# Altium project EGT_CAN.PrjPcb
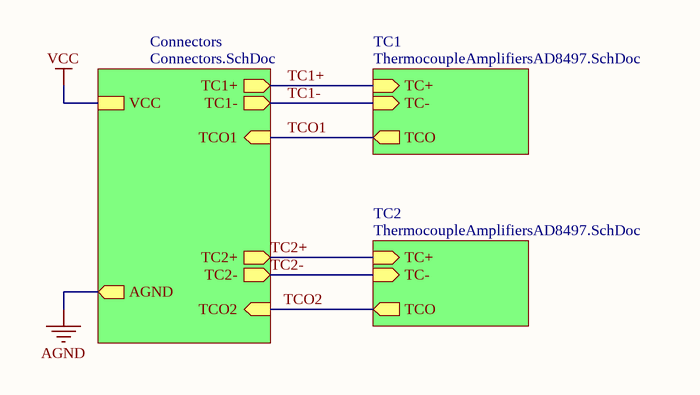
[diagram p0: Top Level.SchDoc]
3 sheets, 29 parts. Net scope: hierarchical (ports join the sheet entries above them; power ports are global).
Board file: EGT_CAN.PcbDoc
Sheets:
  Top Level.SchDoc
    TC1 = ThermocoupleAmplifiersAD8497.SchDoc
    TC2 = ThermocoupleAmplifiersAD8497.SchDoc
    Connectors = Connectors.SchDoc

## Sheet Top Level.SchDoc
size A

### Sub-sheets
Connectors = Connectors.SchDoc: TC2- (out), TC1- (out), TC1+ (out), TC2+ (out), TCO1 (in), AGND (out), TCO2 (in), VCC
TC1 = ThermocoupleAmplifiersAD8497.SchDoc: TCO (out), TC+ (in), TC- (in)
TC2 = ThermocoupleAmplifiersAD8497.SchDoc: TCO (out), TC+ (in), TC- (in)

### Nets
TC1+: sheet TC1/TC+, sheet Connectors/TC1+
TC1-: sheet TC1/TC-, sheet Connectors/TC1-
TC2+: sheet TC2/TC+, sheet Connectors/TC2+
TC2-: sheet TC2/TC-, sheet Connectors/TC2-
TCO1: sheet TC1/TCO, sheet Connectors/TCO1
TCO2: sheet TC2/TCO, sheet Connectors/TCO2

## Sheet ThermocoupleAmplifiersAD8497.SchDoc
size A
Used 2 times, as channels TC1, TC2. Parts and nets are listed once, with the designators drawn on the sheet.
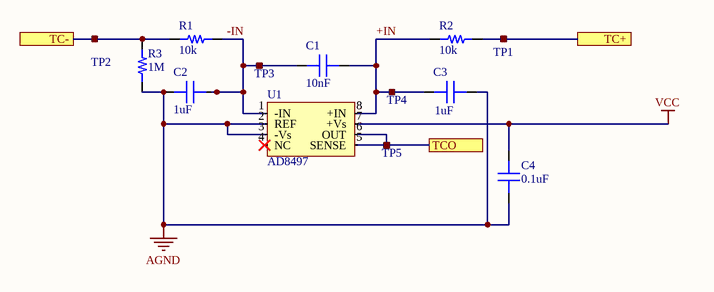
[diagram p1: ThermocoupleAmplifiersAD8497.SchDoc]

### Parts
C1  capacitance: 10nF  [0603]  (hidden comment: capacitor)
C2  capacitance: 1uF  [0603]  (hidden comment: capacitor)
C3  capacitance: 1uF  [0603]  (hidden comment: capacitor)
C4  capacitance: 0.1uF  [0603]  (hidden comment: capacitor)
R1  10k  [RES 0603/1608]
R2  10k  [RES 0603/1608]
R3  1M  [RES 0603/1608]
TP1  RCU-0C  [RCU-0C]  (value not drawn)
TP2  RCU-0C  [RCU-0C]  (value not drawn)
TP3  RCU-0C  [RCU-0C]  (value not drawn)
TP4  RCU-0C  [RCU-0C]  (value not drawn)
TP5  RCU-0C  [RCU-0C]  (value not drawn)
U1  AD8497  [MSOP-8]

### Ports
TC+, TC-, TCO

### Nets
AGND: C2.1 C3.2 C4.1 R3.1 U1.2(REF) U1.3(-Vs)
VCC: C4.2 U1.7(+Vs)
+IN: C1.2 C3.1 R2.1 TP4.1 U1.8(+IN)
-IN: C1.1 C2.2 R1.2 TP3.1 U1.1(-IN)
TC+: R2.2 TP1.1 ; port TC+
TC-: R1.1 R3.2 TP2.1 ; port TC-
TCO: TP5.1 U1.5(SENSE) U1.6(OUT) ; port TCO

Not connected (* = marked no-connect by the designer): U1 4(NC)*

### Channels
TC1: designators C1=C6 C2=C8 C3=C7 C4=C1 R1=R5 R2=R6 R3=R4 TP1=TP7 TP2=TP6 TP3=TP9 TP4=TP8 TP5=TP10 U1=U1; ports TC+=TC1+ TC-=TC1- TCO=TCO1
TC2: designators C1=C5 C2=C4 C3=C3 C4=C2 R1=R2 R2=R1 R3=R3 TP1=TP4 TP2=TP5 TP3=TP2 TP4=TP3 TP5=TP1 U1=U2; ports TC+=TC2+ TC-=TC2- TCO=TCO2

### Library data of the parts
C1-C3 = 1: Generic 0603 capacitor; dielectric: Ceramic; ESR: 1; voltage: 50; percent tolerance: 10; name: 0603 Capacitor; package: 0603; id: 1; quantity: 0
C4 = 1: Generic 0603 capacitor; id: 1; voltage: 50; dielectric: Ceramic; percent tolerance: 10; name: 0603 Capacitor; ESR: 1; package: 0603; quantity: 0
R1-R3 = 1: name: 0603 Resistor; id: 1; percent tolerance: 5; package: 0603; quantity: 0
  R1 R2: resistance: 10k
  R3: resistance: 1M
TP1-TP5 = 14: id: 14; numcontacts: 1; name: RCU-0C; link: https://www.digikey.com/product-detail/en/te-connectivity-amp-connectors/RCU-0C/A106145CT-ND/3477802; numrows: 1; quantity: 0
U1 = 1: num_circuits: 1; gbw: 0; voltage: 15; link: https://www.digikey.com/product-detail/en/analog-devices-inc/AD8497ARMZ/AD8497ARMZ-ND/2404367; id: 1; slewrate: 0; currentoutput: 0; voltagelow: 0; voltagehigh: 0; quantity: 0

## Sheet Connectors.SchDoc
size A
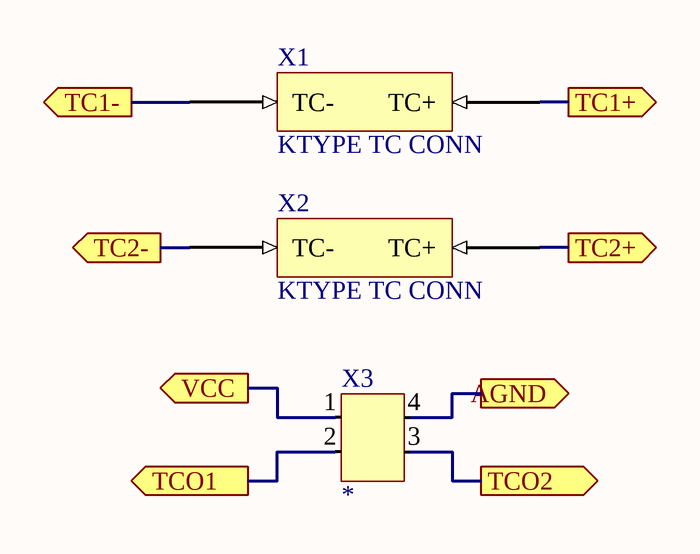
[diagram p2: Connectors.SchDoc]

### Parts
X1  KTYPE TC CONN  [KTYPE TC CONN]
X2  KTYPE TC CONN  [KTYPE TC CONN]
X3  *  [DTF13-4P]

### Ports
AGND (out), TC1+ (out), TC1- (out), TC2+ (out), TC2- (out), TCO1 (out), TCO2 (out), VCC (out)

### Nets
AGND: X3.4 ; port AGND
VCC: X3.1 ; port VCC
TC1+: X1.TC+ ; port TC1+
TC1-: X1.TC- ; port TC1-
TC2+: X2.TC+ ; port TC2+
TC2-: X2.TC- ; port TC2-
TCO1: X3.2 ; port TCO1
TCO2: X3.3 ; port TCO2

### Library data of the parts
X1 X2 = 35: K type thermocouple vertical conn; id: 35; numcontacts: 2; numrows: 1; pitch: 0; updatedby: gutmanndan; name: KTYPE TC CONN; quantity: 0; package: 1; link: https://evosensors.com/products/k1x-femx-con-fp-x-pccs; createdby: gutmanndan; createddate: 11/20/2019 7:50:17 PM; updateddate: 11/20/2019 7:50:17 PM
X3 = 15: DTF13-4P; id: 15; numcontacts: 4; MfrPartNo: *; name: DTF13-4P; quantity: 0; link: https://www.te.com/usa-en/product-DTF13-4P.html

## Nets that join several sheets
AGND: TC1 (6 pins), TC2 (6 pins), Connectors (X3.4)
VCC: TC1 (C1.2 U1.7), TC2 (C2.2 U2.7), Connectors (X3.1)
TC1+: TC1 (R6.2 TP7.1), Connectors (X1.TC+)
TC1-: TC1 (R4.2 R5.1 TP6.1), Connectors (X1.TC-)
TC2+: TC2 (R1.2 TP4.1), Connectors (X2.TC+)
TC2-: TC2 (R2.1 R3.2 TP5.1), Connectors (X2.TC-)
TCO1: TC1 (TP10.1 U1.5 U1.6), Connectors (X3.2)
TCO2: TC2 (TP1.1 U2.5 U2.6), Connectors (X3.3)